# EasyEDA Pro project do_an1_easyeda.eprj

# Schematic Schematic1
Board Name: Board1; Create Date: 2026-05-09; Page Name: P1; Project Name: do_an1_easyeda; Schematic Name: Schematic1; Update Date: 2026-05-25; Company: EasyEDA.com; Page Size: A4; Version: V1.0
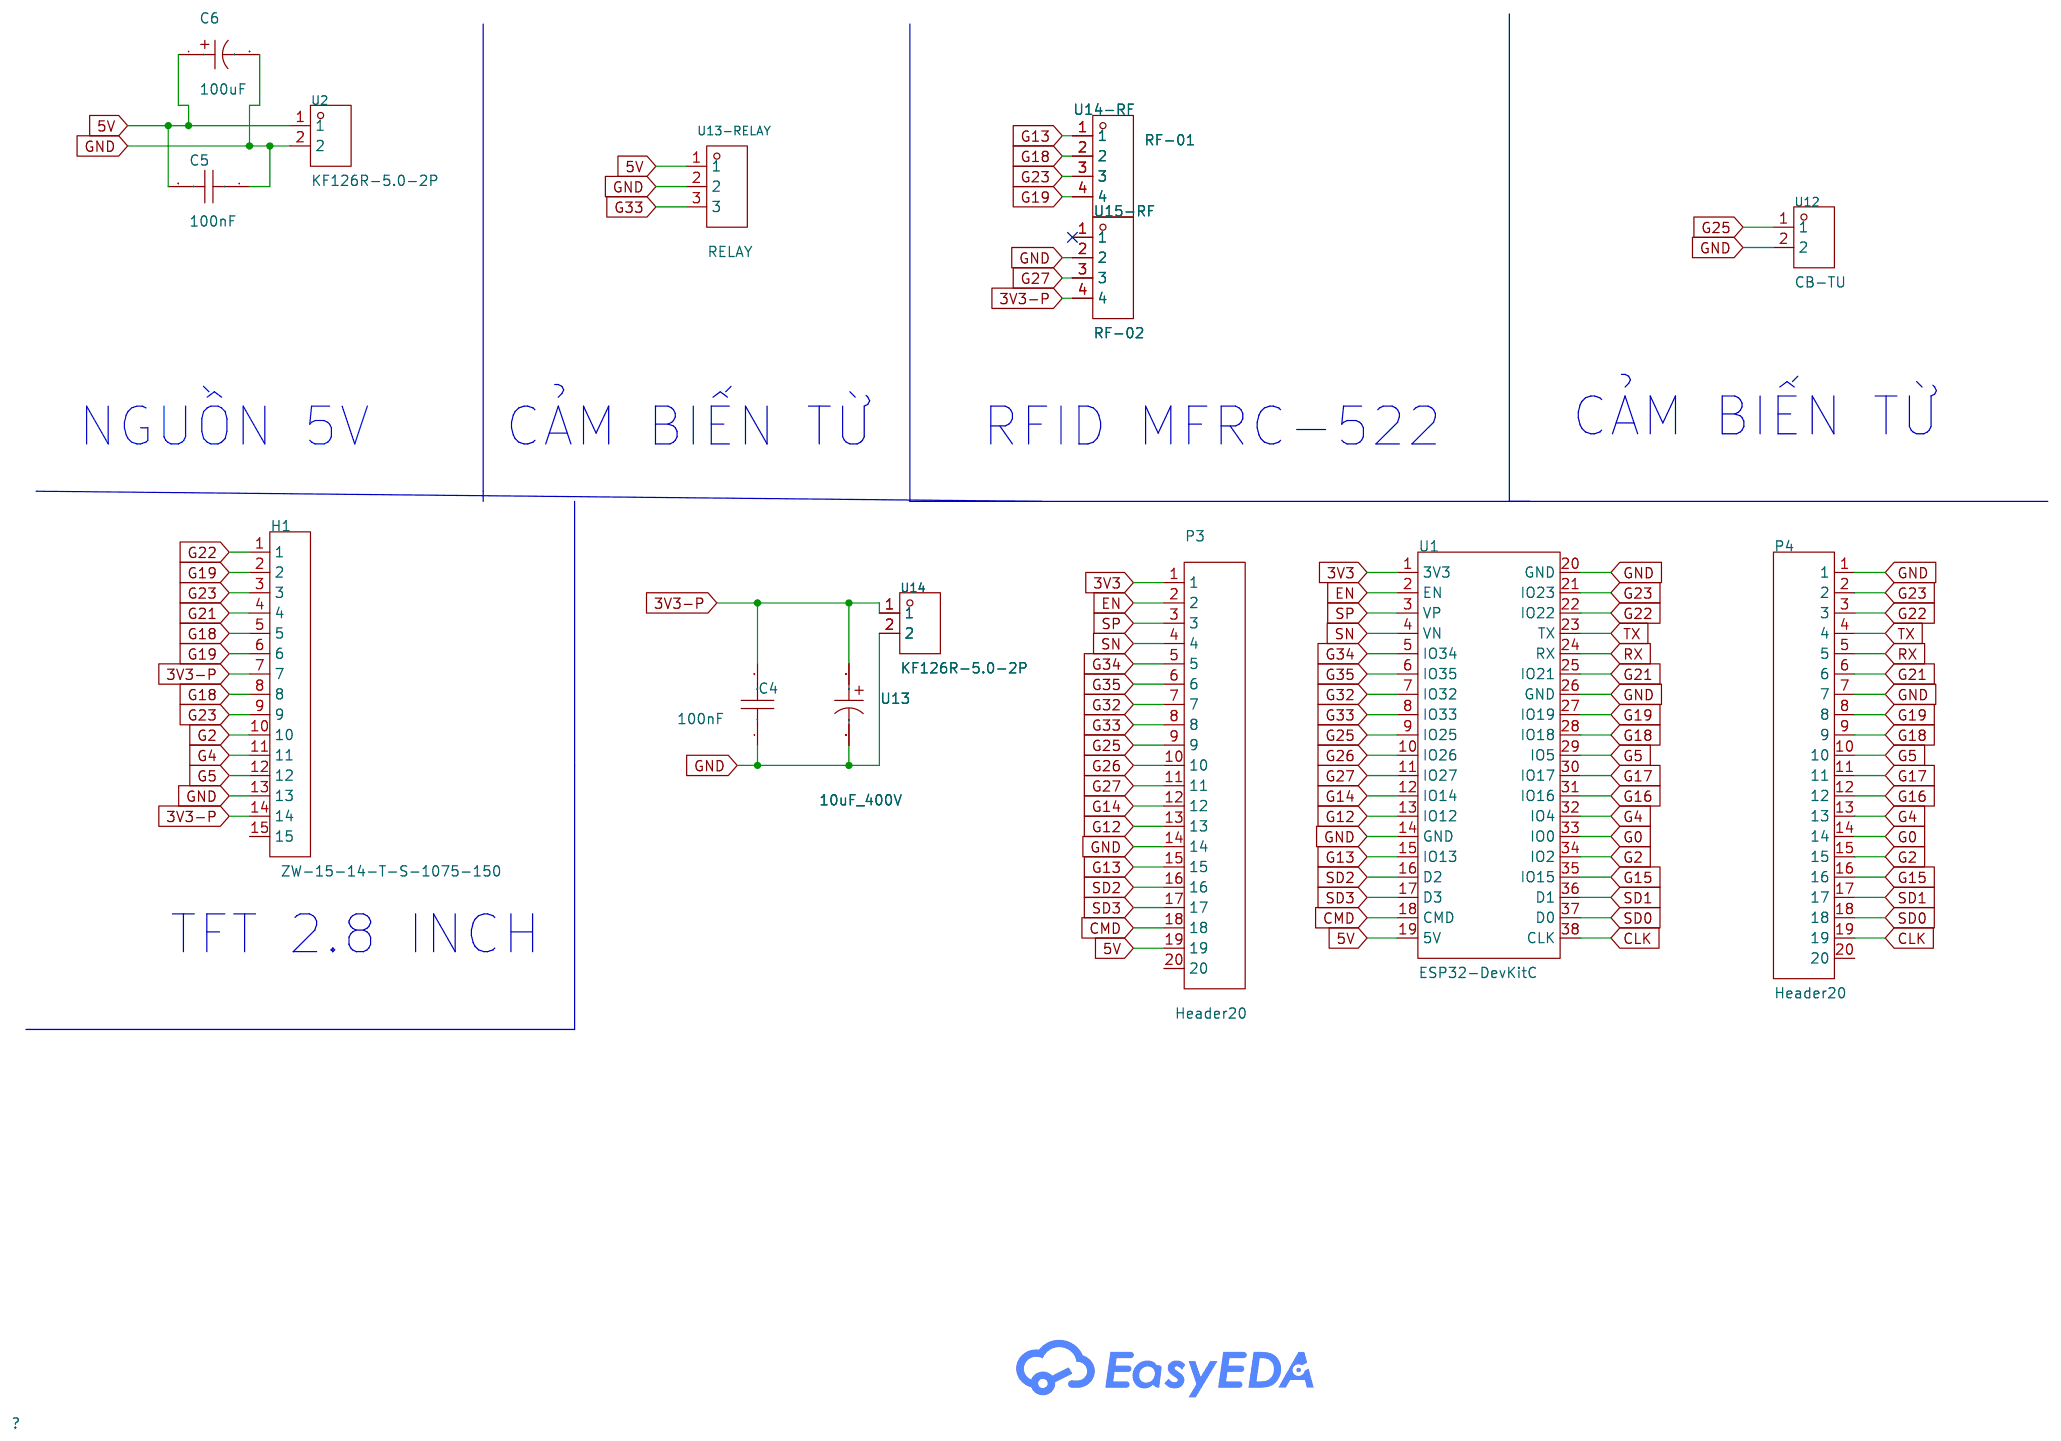
[diagram p0: schematic sheet]

## Parts
C4  100nF  [CAP-TH_L5.0-W2.5-P5.00-D1.0]
C5  100nF  [CAP-TH_L5.0-W2.5-P5.00-D1.0]
C6  100uF  [CAP-TH_BD6.3-P2.50-D0.6-FD-H12.0-1]
H1  ZW-15-14-T-S-1075-150  [HDR-TH_DW-15-09-S-S-415]
P3  Header20  [HDR-TH_20P-P2.54-V-M-1]
P4  Header20  [HDR-TH_20P-P2.54-V-M-1]
U1  ESP32-DevKitC  [BULETM-SMD_ESP32-DEVKITC]
U2  KF126R-5.0-2P  [CONN-TH_P5.00_KF126R-5.0-2P]
U12  CB-TU  [CONN-TH_P5.00_KF126R-5.0-2P]
U13  10uF_400V  [CAP-TH_BD10.0-P5.00-D0.6-FD]
U13-RELAY  RELAY  [CONN-TH_3P-P5.00_KF126R-5.0-3P]
U14  KF126R-5.0-2P  [CONN-TH_P5.00_KF126R-5.0-2P]
U14-RF  RF-01  [HDR-TH_4P-P2.54-V-M-4]
U15-RF  RF-02  [HDR-TH_4P-P2.54-V-M-4]

## Library data of the parts
C4 C5 = CC1H104MC1FD3F6C10MF: LCSC Part Name: 100nF ±20% 50V; Supplier Part: C254085; Manufacturer: Dersonic(德尔创); Supplier Footprint: 插件,P=5.08mm; JLCPCB Part Class: Extended Part; Datasheet: https://item.szlcsc.com/datasheet/CC1H104MC1FD3F6C10MF/248635.html; Supplier: LCSC; Tolerance: ±20%; Voltage Rating: 50V; Pin Spacing: 5.08mm; Temperature Coefficient: Y5V; Diameter: 6mm; Body Thickness: 2.2mm
C6 = CD288H1HM101E120T: LCSC Part Name: 100uF ±20% 50V; Supplier Part: C52994849; Manufacturer: CH(创慧电子); Supplier Footprint: 插件,D6.3xL12mm; JLCPCB Part Class: Extended Part; Datasheet: https://item.szlcsc.com/datasheet/CD288H1HM101E120T/55932912.html; Supplier: LCSC; Tolerance: ±20%; Voltage Rating: 50V; Pin Spacing: 2.5mm; Diameter: 6.3mm; Height - Seated (Max): 12mm; Lifetime: 3000hrs@105℃; Operating Temperature: -40℃~+105℃
H1 = ZW-15-14-T-S-1075-150: LCSC Part Name: 间距:2.54mm 直插; Supplier Part: C6364203; Manufacturer: SAMTEC; Supplier Footprint: 插件,P=2.54mm; JLCPCB Part Class: Extended Part; Datasheet: https://item.szlcsc.com/datasheet/ZW-15-14-T-S-1075-150/7313585.html; Supplier: LCSC; Pitch: 2.54mm; Mounting Type: Through Hole; Number of Rows: 1; Number of Pins: 15P; Contact Plating: Tin; Color: Black
P3 P4 = B-2100S20P-A110: Pin Structure:1x20P Pitch:2.54mm Row Spacing:- Circluar Pins/Square Pins:- Mounting Type:Through Hole Number of Rows:1 Number of Pins:20P Current Rating:- Voltage Rating (Max):- Length of Mating Pin:6mm Insulation Height:2.54mm Length of End Connection Pi; LCSC Part Name: 2.54直排针; Supplier Part: C124374; Manufacturer: Ckmtw(灿科盟); Supplier Footprint: 插件,P=2.54mm; JLCPCB Part Class: Extended Part; Datasheet: https://item.szlcsc.com/datasheet/B-2100S20P-A110/125649.html; Supplier: LCSC; Pin Structure: 1x20P; Pitch: 2.54mm; Mounting Type: Through Hole; Number of Rows: 1; Number of Pins: 20P; Length of Mating Pin: 6mm; Insulation Height: 2.54mm; Length of End Connection Pin: 3mm; Contact Material: Brass; Operating Temperature: -40℃~+105℃; Color: Black
U1 = ESP32-DevKitC: LCSC Part Name: 开发板; Supplier Part: C571180; Manufacturer: ESPRESSIF(乐鑫); JLCPCB Part Class: Extended Part; Datasheet: https://atta.szlcsc.com/upload/public/pdf/source/20200521/C529586_D6FCDAFCFF160B3EDDF7DF28D600699D.pdf; Supplier: LCSC
U2 U12 U14 = KF126R-5.0-2P: LCSC Part Name: 1x2P 5mm 弯插 排数:1 每排P数:2; Supplier Part: C474902; Manufacturer: KEFA(科发); Supplier Footprint: 弯插,P=5mm; JLCPCB Part Class: Extended Part; Datasheet: https://item.szlcsc.com/datasheet/KF126R-5.0-2P/481520.html; Supplier: LCSC; Number of Positions or Pins: 1x2P; Pitch: 5mm; Color: Green; Mounting Type: Right Angle; Number of Pins: 2P; Number of Rows: 1; Number of PINs Per Row: 2; Current Rating: 18A; Voltage Rating (Max): 250V; Wire Gauge - AWG: 14~26; Wire Gauge - mm2: 2.5; Operating Temperature: -40℃~+105℃
U13 = 10uF_400V: Supplier Part: C9900016271; Supplier Footprint: Capacitor_THT:CP_Radial_D10.0mm_P5.00mm; JLCPCB Part Class: Extended Part; Supplier: LCSC
U13-RELAY = KF126R-5.0-3P: LCSC Part Name: 5mm 1x3P 排数:1 每排P数:3 弯插; Supplier Part: C474903; Manufacturer: KEFA(科发); Supplier Footprint: 弯插,P=5mm; JLCPCB Part Class: Extended Part; Datasheet: https://atta.szlcsc.com/upload/public/pdf/source/20230317/D4AEDDEB3CC7F8C1DB6BB9C15DEDB74A.pdf; Supplier: LCSC; Structure: 1x3P; Pitch: 5mm; Color: Green; Mounting Style: Right-Angle; Current Rating (Max): 18A; Voltage Rating (Max): 250V; Number of Pins: 3P; Number of Rows: 1; Wire Gauge - AWG: 14~26; Wire Gauge - mm2: 2.5; Number of PINs Per Row: 3; Operating Temperature Range: -40℃~+105℃
U14-RF U15-RF = PH254-104-21mm: Supplier Part: C9900027204; Supplier Footprint: PH254-104-LI; JLCPCB Part Class: Extended Part; Supplier: LCSC

## Nets
3V3: P3.1 U1.1(3V3)
3V3-P: C4.2 H1.7 H1.14 U13.1 U14.1 U15-RF.4
5V: C5.2 C6.1 P3.19 U1.19(5V) U2.1 U13-RELAY.1
GND: C4.1 C5.1 C6.2 H1.13 P3.14 P4.1 P4.7 U1.14(GND) U1.20(GND) U1.26(GND) U2.2 U12.2 U13.2 U13-RELAY.2 U14.2 U15-RF.2
CLK: P4.19 U1.38(CLK)
CMD: P3.18 U1.18(CMD)
EN: P3.2 U1.2(EN)
G0: P4.14 U1.33(IO0)
G2: H1.10 P4.15 U1.34(IO2)
G4: H1.11 P4.13 U1.32(IO4)
G5: H1.12 P4.10 U1.29(IO5)
G12: P3.13 U1.13(IO12)
G13: P3.15 U1.15(IO13) U14-RF.1
G14: P3.12 U1.12(IO14)
G15: P4.16 U1.35(IO15)
G16: P4.12 U1.31(IO16)
G17: P4.11 U1.30(IO17)
G18: H1.5 H1.8 P4.9 U1.28(IO18) U14-RF.2
G19: H1.2 H1.6 P4.8 U1.27(IO19) U14-RF.4
G21: H1.4 P4.6 U1.25(IO21)
G22: H1.1 P4.3 U1.22(IO22)
G23: H1.3 H1.9 P4.2 U1.21(IO23) U14-RF.3
G25: P3.9 U1.9(IO25) U12.1
G26: P3.10 U1.10(IO26)
G27: P3.11 U1.11(IO27) U15-RF.3
G32: P3.7 U1.7(IO32)
G33: P3.8 U1.8(IO33) U13-RELAY.3
G34: P3.5 U1.5(IO34)
G35: P3.6 U1.6(IO35)
RX: P4.5 U1.24(RX)
SD0: P4.18 U1.37(D0)
SD1: P4.17 U1.36(D1)
SD2: P3.16 U1.16(D2)
SD3: P3.17 U1.17(D3)
SN: P3.4 U1.4(VN)
SP: P3.3 U1.3(VP)
TX: P4.4 U1.23(TX)

Not connected (* = marked no-connect by the designer): H1 15; P3 20; P4 20; U15-RF 1*

## Notes on the sheet
- NGUỒN 5V
- CẢM BIẾN TỪ
- RFID MFRC-522
- CẢM BIẾN TỪ
- TFT 2.8 INCH

# Board PCB1
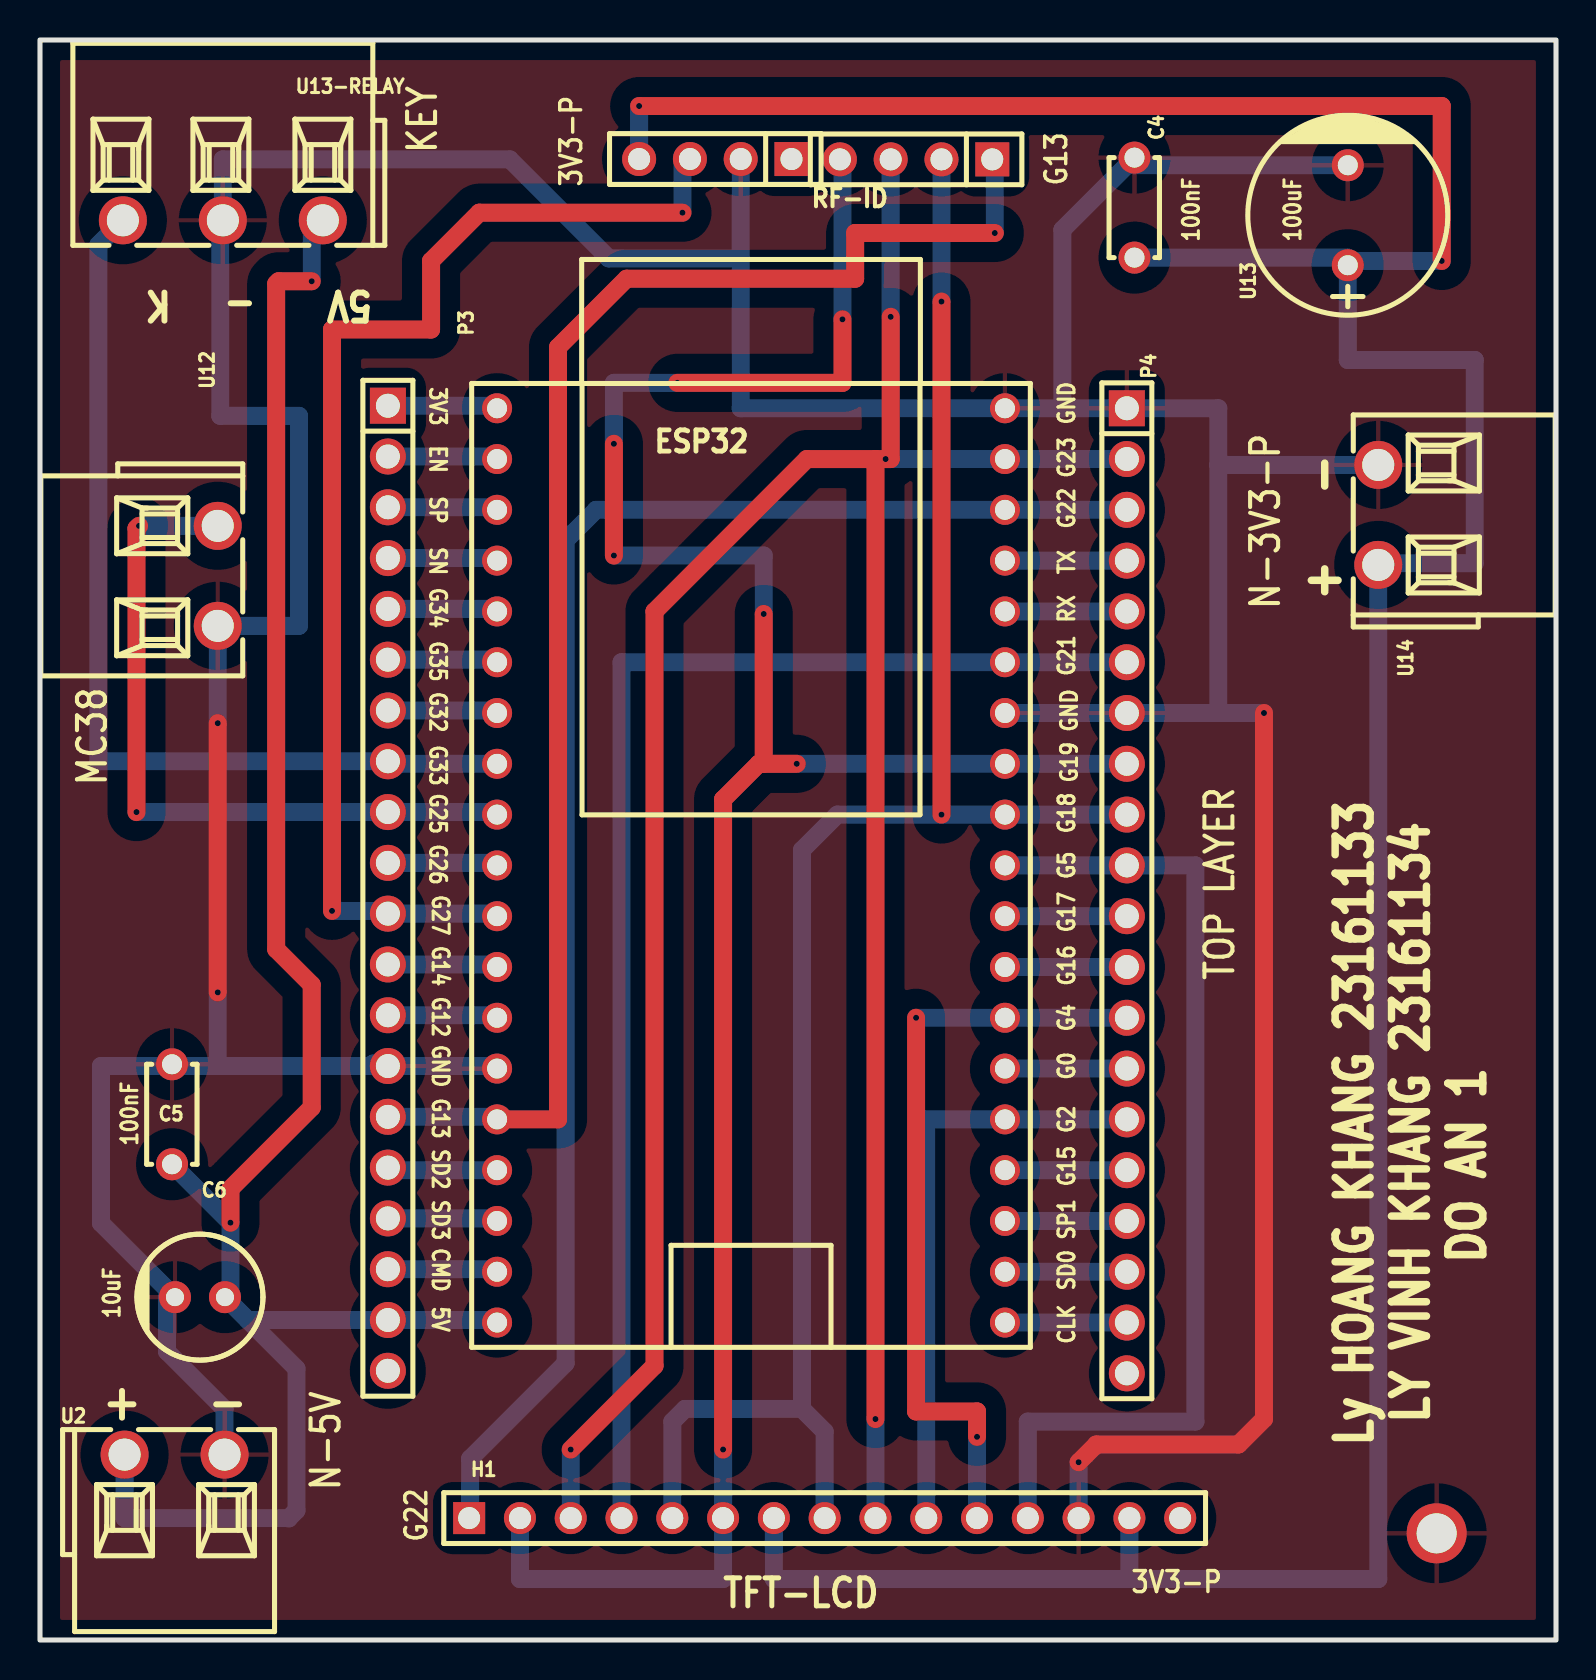
[diagram p1: board, top side]
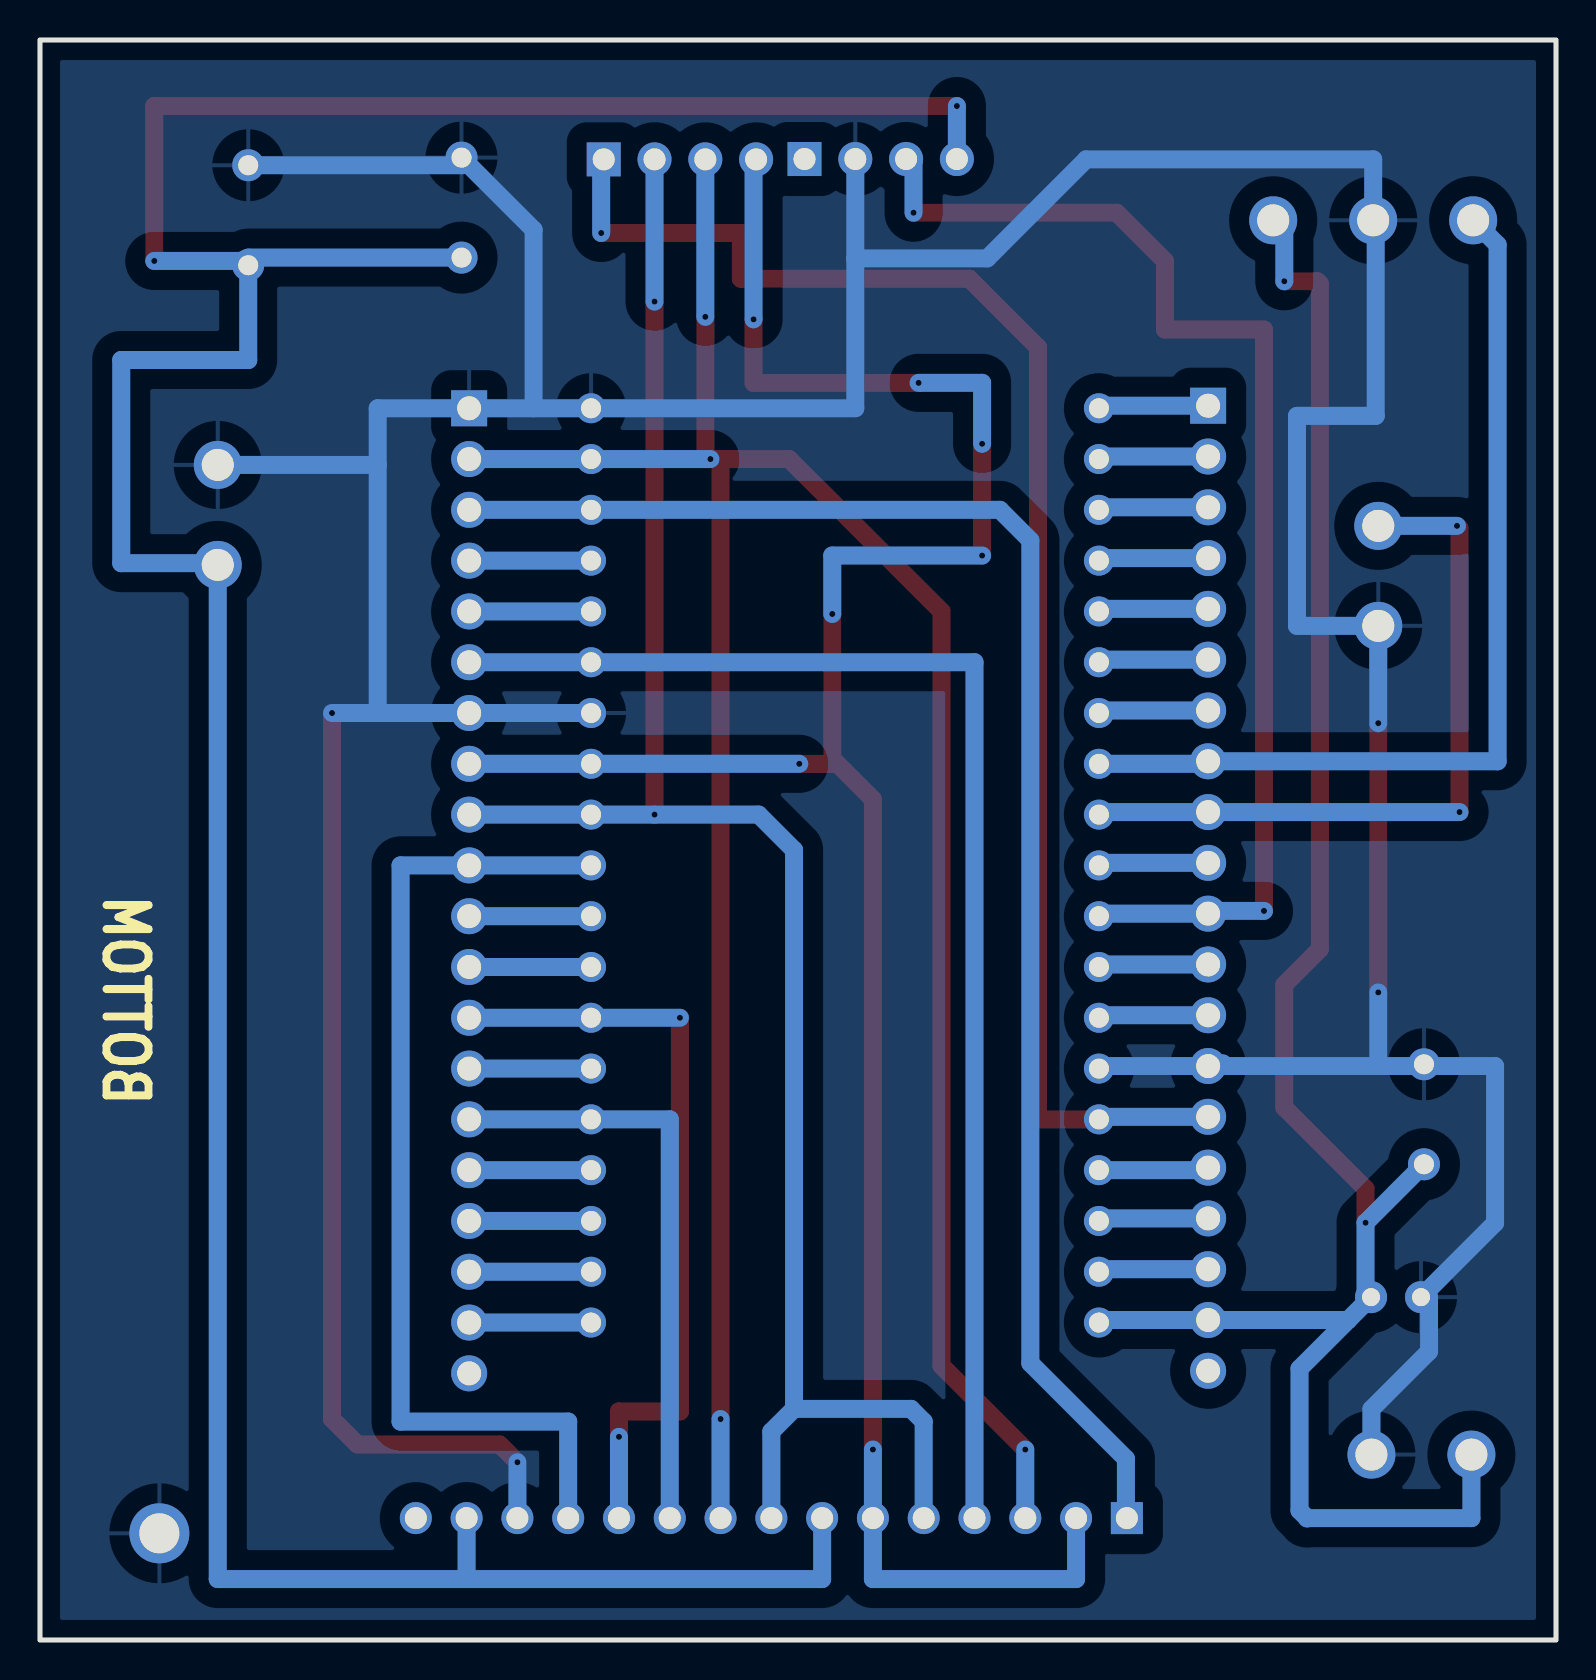
[diagram p2: board, bottom side, seen from below]

Outline 75.82 x 80.01 mm; copper layers: Top Layer, Bottom Layer. Coordinates in mm from the lower left corner of the outline.
Outline path: rectangle 0,80.01 75.82,0
Stack: Top Layer 0.035mm / Dielectric1 1.51mm FR4 er 4.5 / Bottom Layer 0.035mm

## Design rules (mm)
template: Custom Config
spacing copperThickness1oz (default): track to track 0.102, other pairs 0.152 to 0.3
spacing copperThickness2oz: track to track 0.203, other pairs 0.152 to 0.3
track width copperThickness1oz (default): min 0.127, default 0.8, max 2.54
track width copperThickness2oz: min 0.203, default 0.4, max 2.54
differential pair differentialPair (default): width min 0.127, default 0.254, max 2.54; gap min 0.152, default 0.152
via viaSize (default): diameter min 0.5, default 0.61, max 10; hole min 0.3, default 0.305, max 6.3

## Placement (name value [footprint] x y rotation side)
C4  100nF  [CAP-TH_L5.0-W2.5-P5.00-D1.0]  54.74 71.63 270 top
C5  100nF  [CAP-TH_L5.0-W2.5-P5.00-D1.0]  6.6 26.29 270 top
C6  100uF  [CAP-TH_BD6.3-P2.50-D0.6-FD-H12.0-1]  8 17.14 180 top
ESP32  ESP32-DevKitC  [BULETM-SMD_ESP32-DEVKITC]  35.56 38.73 270 top
H1  ZW-15-14-T-S-1075-150  [HDR-TH_DW-15-09-S-S-415]  39.24 6.1 0 top
NOREF  -  [Pad_e1441]  69.85 5.33 0 top
P3  Header20  [HDR-TH_20P-P2.54-V-M-1]  17.4 37.59 270 top
P4  Header20  [HDR-TH_20P-P2.54-V-M-1]  54.36 37.47 270 top
RF-ID  RF-01  [HDR-TH_4P-P2.54-V-M-4]  43.81 74.04 180 top
U2  KF126R-5.0-2P  [CONN-TH_P5.00_KF126R-5.0-2P]  6.73 9.27 0 top
U12  CB-TU  [CONN-TH_P5.00_KF126R-5.0-2P]  8.89 53.21 270 top
U13  10uF_400V  [CAP-TH_BD10.0-P5.00-D0.6-FD]  65.41 71.25 90 top
U13-RELAY  RELAY  [CONN-TH_3P-P5.00_KF126R-5.0-3P]  9.14 70.99 180 top
U14  KF126R-5.0-2P  [CONN-TH_P5.00_KF126R-5.0-2P]  66.93 56.26 90 top
U15-RF  RF-02  [HDR-TH_4P-P2.54-V-M-4]  33.77 74.06 180 top

## Footprints (pads in the part's own frame, mm; a bottom-side part is the same pattern mirrored in y, then rotated)
BULETM-SMD_ESP32-DEVKITC
  round 1.5 hole 1: 1(-22.86,-12.7) 2(-20.32,-12.7) 3(-17.78,-12.7) 4(-15.24,-12.7) 5(-12.7,-12.7) 6(-10.16,-12.7) 7(-7.62,-12.7) 8(-5.08,-12.7) 9(-2.54,-12.7) 10(0,-12.7) 11(2.54,-12.7) 12(5.08,-12.7) 13(7.62,-12.7) 14(10.16,-12.7) 15(12.7,-12.7) 16(15.24,-12.7) 17(17.78,-12.7) 18(20.32,-12.7) 19(22.86,-12.7) 20(-22.86,12.7) 21(-20.32,12.7) 22(-17.78,12.7) 23(-15.24,12.7) 24(-12.7,12.7) 25(-10.16,12.7) 26(-7.62,12.7) 27(-5.08,12.7) 28(-2.54,12.7) 29(0,12.7) 30(2.54,12.7) 31(5.08,12.7) 32(7.62,12.7) 33(10.16,12.7) 34(12.7,12.7) 35(15.24,12.7) 36(17.78,12.7) 37(20.32,12.7) 38(22.86,12.7)
CAP-TH_BD6.3-P2.50-D0.6-FD-H12.0-1
  round 1.6 hole 0.9: 1(-1.25,0) 2(1.25,0)
CAP-TH_BD10.0-P5.00-D0.6-FD
  round 1.6 hole 1: 1(-2.5,0) 2(2.5,0)
CAP-TH_L5.0-W2.5-P5.00-D1.0
  round 1.6 hole 1: 1(-2.5,0) 2(2.5,0)
CONN-TH_3P-P5.00_KF126R-5.0-3P
  round 2.4 hole 1.6: 1(-5,0) 2(0,0) 3(5,0)
CONN-TH_P5.00_KF126R-5.0-2P
  round 2.4 hole 1.6: 1(-2.5,0) 2(2.5,0)
HDR-TH_4P-P2.54-V-M-4
  rect 1.7x1.7 hole 1.1: 1(-3.81,0)
  round 1.7 hole 1.1: 2(-1.27,0) 3(1.27,0) 4(3.81,0)
HDR-TH_20P-P2.54-V-M-1
  rect 1.8x1.8 hole 1.2: 1(-24.13,0)
  round 1.8 hole 1.2: 2(-21.59,0) 3(-19.05,0) 4(-16.51,0) 5(-13.97,0) 6(-11.43,0) 7(-8.89,0) 8(-6.35,0) 9(-3.81,0) 10(-1.27,0) 11(1.27,0) 12(3.81,0) 13(6.35,0) 14(8.89,0) 15(11.43,0) 16(13.97,0) 17(16.51,0) 18(19.05,0) 19(21.59,0) 20(24.13,0)
HDR-TH_DW-15-09-S-S-415
  rect 1.6x1.6 hole 1.1: 1(-17.78,0)
  round 1.6 hole 1.1: 2(-15.24,0) 3(-12.7,0) 4(-10.16,0) 5(-7.62,0) 6(-5.08,0) 7(-2.54,0) 8(0,0) 9(2.54,0) 10(5.08,0) 11(7.62,0) 12(10.16,0) 13(12.7,0) 14(15.24,0) 15(17.78,0)
Pad_e1441
  round 3 hole 2: 1(0,0)

## Nets
3V3: ESP32.1 P3.1
3V3-P: C4.2 H1.7 H1.14 U13.1 U14.1 U15-RF.4
5V: C5.2 C6.1 ESP32.19 P3.19 U2.1 U13-RELAY.1
GND: C4.1 C5.1 C6.2 ESP32.14 ESP32.20 ESP32.26 H1.13 NOREF.1 P3.14 P4.1 P4.7 U2.2 U12.2 U13.2 U13-RELAY.2 U14.2 U15-RF.2
CLK: ESP32.38 P4.19
CMD: ESP32.18 P3.18
EN: ESP32.2 P3.2
G0: ESP32.33 P4.14
G2: ESP32.34 H1.10 P4.15
G4: ESP32.32 H1.11 P4.13
G5: ESP32.29 H1.12 P4.10
G12: ESP32.13 P3.13
G13: ESP32.15 P3.15 RF-ID.1
G14: ESP32.12 P3.12
G15: ESP32.35 P4.16
G16: ESP32.31 P4.12
G17: ESP32.30 P4.11
G18: ESP32.28 H1.5 H1.8 P4.9 RF-ID.2
G19: ESP32.27 H1.2 H1.6 P4.8 RF-ID.4
G21: ESP32.25 H1.4 P4.6
G22: ESP32.22 H1.1 P4.3
G23: ESP32.21 H1.3 H1.9 P4.2 RF-ID.3
G25: ESP32.9 P3.9 U12.1
G26: ESP32.10 P3.10
G27: ESP32.11 P3.11 U15-RF.3
G32: ESP32.7 P3.7
G33: ESP32.8 P3.8 U13-RELAY.3
G34: ESP32.5 P3.5
G35: ESP32.6 P3.6
RX: ESP32.24 P4.5
SD0: ESP32.37 P4.18
SD1: ESP32.36 P4.17
SD2: ESP32.16 P3.16
SD3: ESP32.17 P3.17
SN: ESP32.4 P3.4
SP: ESP32.3 P3.3
TX: ESP32.23 P4.4

Pads without a net: H1 15; P3 20; P4 20; U15-RF 1

## Via types
v1: diameter 0.61, hole 0.305, Top Layer to Bottom Layer, 28 vias

## Routing (per net, layer and track width the routed paths; a pad name or vN(x,y) marks a point on that pad's centre or on a via; arc(x,y) is an arc through that point)
3V3: length 5.6
  Bottom Layer w0.899: ESP32.1 22.86,61.72 P3.1
3V3-P: length 179.6
  Top Layer w0.899: v1(70.1,68.96) 70.1,76.71 v1(29.96,76.71)
  Bottom Layer w0.899: v1(29.96,76.71) 29.96,74.18 29.84,74.06 ; U13.1 65.41,64.01 71.75,64.01 71.75,53.85 66.93,53.85 U14.1 66.93,3.05 54.61,3.05 ; H1.14 54.48,3.18 54.61,3.05 ; v1(70.1,68.96) 65.41,68.96 65.41,69.13 54.48,69.13 ; 54.61,3.05 36.7,3.05 H1.7
5V: length 99.3
  Top Layer w0.899: v1(9.53,20.87) 9.53,22.57 13.59,26.63 13.59,32.77 11.81,34.54 11.81,67.82 11.94,67.95 v1(13.59,67.95)
  Bottom Layer w0.899: 10.39,16 12.83,13.57 12.83,6.48 12.45,6.1 ; 10.39,16 C6.1 9.53,17.14 v1(9.53,20.87) C5.2 ; 10.39,16 P3.19 22.86,16 ESP32.19 ; 12.45,6.1 4.23,6.1 U2.1 ; 12.45,6.1 12.45,6.08 ; v1(13.59,67.95) 13.59,70.44 U13-RELAY.1
GND: length 269.8
  Top Layer w0.899: v1(51.94,8.89) 52.83,9.78 59.94,9.78 61.21,11.05 v1(61.21,46.36) ; v1(8.89,45.85) v1(8.89,32.39)
  Bottom Layer w0.899: U2.2 9.23,11.55 6.35,14.43 6.35,17.14 C6.2 3.05,20.85 3.05,28.7 8.89,28.7 ; 8.89,28.7 16.54,28.7 16.67,28.83 16.99,28.83 17.11,28.7 P3.14 22.86,28.7 ESP32.14 ; 8.89,28.7 v1(8.89,32.39) ; 58.93,58.76 58.93,61.59 P4.1 51.13,61.59 ; 58.93,58.76 58.93,46.36 ; 58.93,58.76 U14.2 ; 58.93,46.36 P4.7 ESP32.26 ; 58.93,46.36 v1(61.21,46.36) ; 51.13,61.59 51.13,70.52 C4.1 54.74,73.75 U13.2 ; 51.13,61.59 ESP32.20 35.04,61.59 35.04,69.09 ; 51.94,6.1 v1(51.94,8.89) ; 35.04,69.09 28.45,69.09 23.5,74.04 9.14,74.04 U13-RELAY.2 9.02,70.87 9.02,61.21 12.95,61.21 12.95,50.71 U12.2 v1(8.89,45.85) ; 35.04,69.09 U15-RF.2
CLK: length 6.1
  Bottom Layer w0.899: ESP32.38 P4.19
CMD: length 5.6
  Bottom Layer w0.899: 22.86,18.42 22.86,18.54 P3.18
EN: length 5.6
  Bottom Layer w0.899: P3.2 22.86,59.18 ESP32.2
G0: length 6.1
  Bottom Layer w0.899: ESP32.33 P4.14
G2: length 30
  Bottom Layer w0.899: P4.15 ESP32.34 44.32,26.03 H1.10
G4: length 38.2
  Top Layer w0.899: v1(46.86,10.16) 46.86,11.43 43.81,11.43 v1(43.81,31.11)
  Bottom Layer w0.899: H1.11 v1(46.86,10.16) ; v1(43.81,31.11) 47.88,31.11 ; ESP32.32 P4.13
G5: length 50.5
  Bottom Layer w0.899: ESP32.29 P4.10 57.78,38.73 57.78,10.92 49.4,10.92 H1.12
G12: length 5.6
  Bottom Layer w0.899: ESP32.13 22.86,31.24 P3.13
G13: length 76.5
  Top Layer w0.899: ESP32.15 25.91,26.03 25.91,64.64 29.34,68.07 40.77,68.07 40.77,70.36 v1(47.75,70.36)
  Bottom Layer w0.899: ESP32.15 22.86,26.16 P3.15 ; RF-ID.1 47.75,73.91 v1(47.75,70.36)
G14: length 5.6
  Bottom Layer w0.899: ESP32.12 22.86,33.78 P3.12
G15: length 6.1
  Bottom Layer w0.899: ESP32.35 P4.16
G16: length 6.1
  Bottom Layer w0.899: ESP32.31 P4.12
G17: length 6.1
  Bottom Layer w0.899: 48.26,36.2 P4.11
G18: length 95.2
  Top Layer w0.899: v1(45.09,66.93) v1(45.09,41.28)
  Bottom Layer w0.899: 38.11,11.56 38.11,39.5 39.88,41.28 v1(45.09,41.28) ESP32.28 P4.9 ; 38.11,11.56 32.26,11.56 31.62,10.92 H1.5 ; 38.11,11.56 39.24,10.42 H1.8 ; RF-ID.2 v1(45.09,66.93)
G19: length 122.3
  Top Layer w0.899: v1(37.85,43.81) 36.19,43.81 ; 36.19,43.81 v1(36.19,51.31) ; 36.19,43.81 35.94,43.81 34.16,42.04 v1(34.16,9.53) ; v1(28.7,59.82) v1(28.7,54.23) ; v1(40.13,66.04) 40.13,62.86 v1(31.88,62.86)
  Bottom Layer w0.899: v1(28.7,54.23) 36.19,54.23 v1(36.19,51.31) ; RF-ID.4 40.13,73.91 v1(40.13,66.04) ; v1(28.7,59.82) 28.7,62.86 v1(31.88,62.86) ; P4.8 ESP32.27 v1(37.85,43.81) ; v1(34.16,9.53) 34.16,3.05 24,3.05 24,6.1
G21: length 68.2
  Bottom Layer w0.899: 48.26,48.64 48.01,48.89 29.08,48.89 H1.4 ; ESP32.25 P4.6
G22: length 79.9
  Bottom Layer w0.899: 21.51,6.14 21.51,9.06 26.29,13.84 26.29,54.99 27.81,56.52 ESP32.22 P4.3 ; 21.51,6.14 21.65,6.29 ; 21.51,6.14 H1.1 21.4,6.03
G23: length 142.1
  Top Layer w0.899: v1(42.55,66.17) 42.55,59.06 v1(42.29,59.06) 41.78,59.06 ; v1(26.54,9.53) 30.73,13.72 30.73,51.44 38.35,59.06 41.78,59.06 ; v1(41.78,11.05) 41.78,59.06
  Bottom Layer w0.899: P4.2 ESP32.21 v1(42.29,59.06) ; H1.3 v1(26.54,9.53) ; RF-ID.3 v1(42.55,66.17) ; 41.78,6.1 v1(41.78,11.05)
G25: length 36.5
  Top Layer w0.899: v1(4.83,41.4) 4.83,55.59 v1(4.95,55.71)
  Bottom Layer w0.899: U12.1 v1(4.95,55.71) ; v1(4.83,41.4) P3.9 22.86,41.4 ESP32.9
G26: length 5.6
  Bottom Layer w0.899: P3.10 22.86,38.86 ESP32.10
G27: length 62.5
  Top Layer w0.899: v1(14.61,36.46) 14.61,65.53 19.56,65.53 19.56,68.96 21.97,71.37 v1(32.13,71.37)
  Bottom Layer w0.899: v1(32.13,71.37) 32.13,74.06 U15-RF.3 ; v1(14.61,36.46) 17.26,36.46 P3.11 22.86,36.32 22.86,36.2
G32: length 5.6
  Bottom Layer w0.899: P3.7 22.86,46.48 ESP32.7
G33: length 47.5
  Bottom Layer w0.899: U13-RELAY.3 2.92,69.77 2.92,43.94 P3.8 17.53,43.81 ESP32.8
G34: length 5.6
  Bottom Layer w0.899: ESP32.5 22.86,51.56 P3.5
G35: length 5.6
  Bottom Layer w0.899: ESP32.6 22.86,49.02 P3.6
RX: length 6.1
  Bottom Layer w0.899: ESP32.24 P4.5
SD0: length 6.1
  Bottom Layer w0.899: 48.26,18.42 P4.18
SD1: length 6.1
  Bottom Layer w0.899: ESP32.36 P4.17
SD2: length 5.6
  Bottom Layer w0.899: P3.16 17.4,23.5 ESP32.16
SD3: length 5.6
  Bottom Layer w0.899: P3.17 22.86,21.08 ESP32.17
SN: length 5.6
  Bottom Layer w0.899: P3.4 22.86,54.1 ESP32.4
SP: length 5.6
  Bottom Layer w0.899: ESP32.3 22.86,56.64 P3.3
TX: length 6.1
  Bottom Layer w0.899: ESP32.23 P4.4

## Copper pours and planes (outline as drawn; the poured copper is in the pictures)
GND on Top Layer: 0,80.01 75.82,80.01 75.82,0 0,0
GND on Top Layer: 0,80.01 75.82,80.01 75.82,0 0,0
GND on Bottom Layer: 0,80.01 75.82,80.01 75.82,0 0,0

## Text on the board
Bottom Silkscreen Layer: BOTTOM
Top Silkscreen Layer: 3V3 | EN | SP | SN | G34 | G35 | G32 | G33 | G25 | G26 | G27 | G14 | G12 | GND | G13 | SD2 | SD3 | CMD | 5V | G23 | G22 | TX | RX | G21 | G18 | G5 | G17 | G16 | G4 | G0 | G2 | G15 | SP1 | SD0 | CLK | G19 | 10uF | 100nF | 100uF | 3V3-P | MC38 | N-5V | KEY | TOP LAYER | N-3V3-P | TFT-LCD | 5V    -   K | +   - | Ly HOANG KHANG 23161133 / LY VINH KHANG 23161134 / DO AN 1
